# EAGLE design Relay Switch (EAGLE 9.1.3)
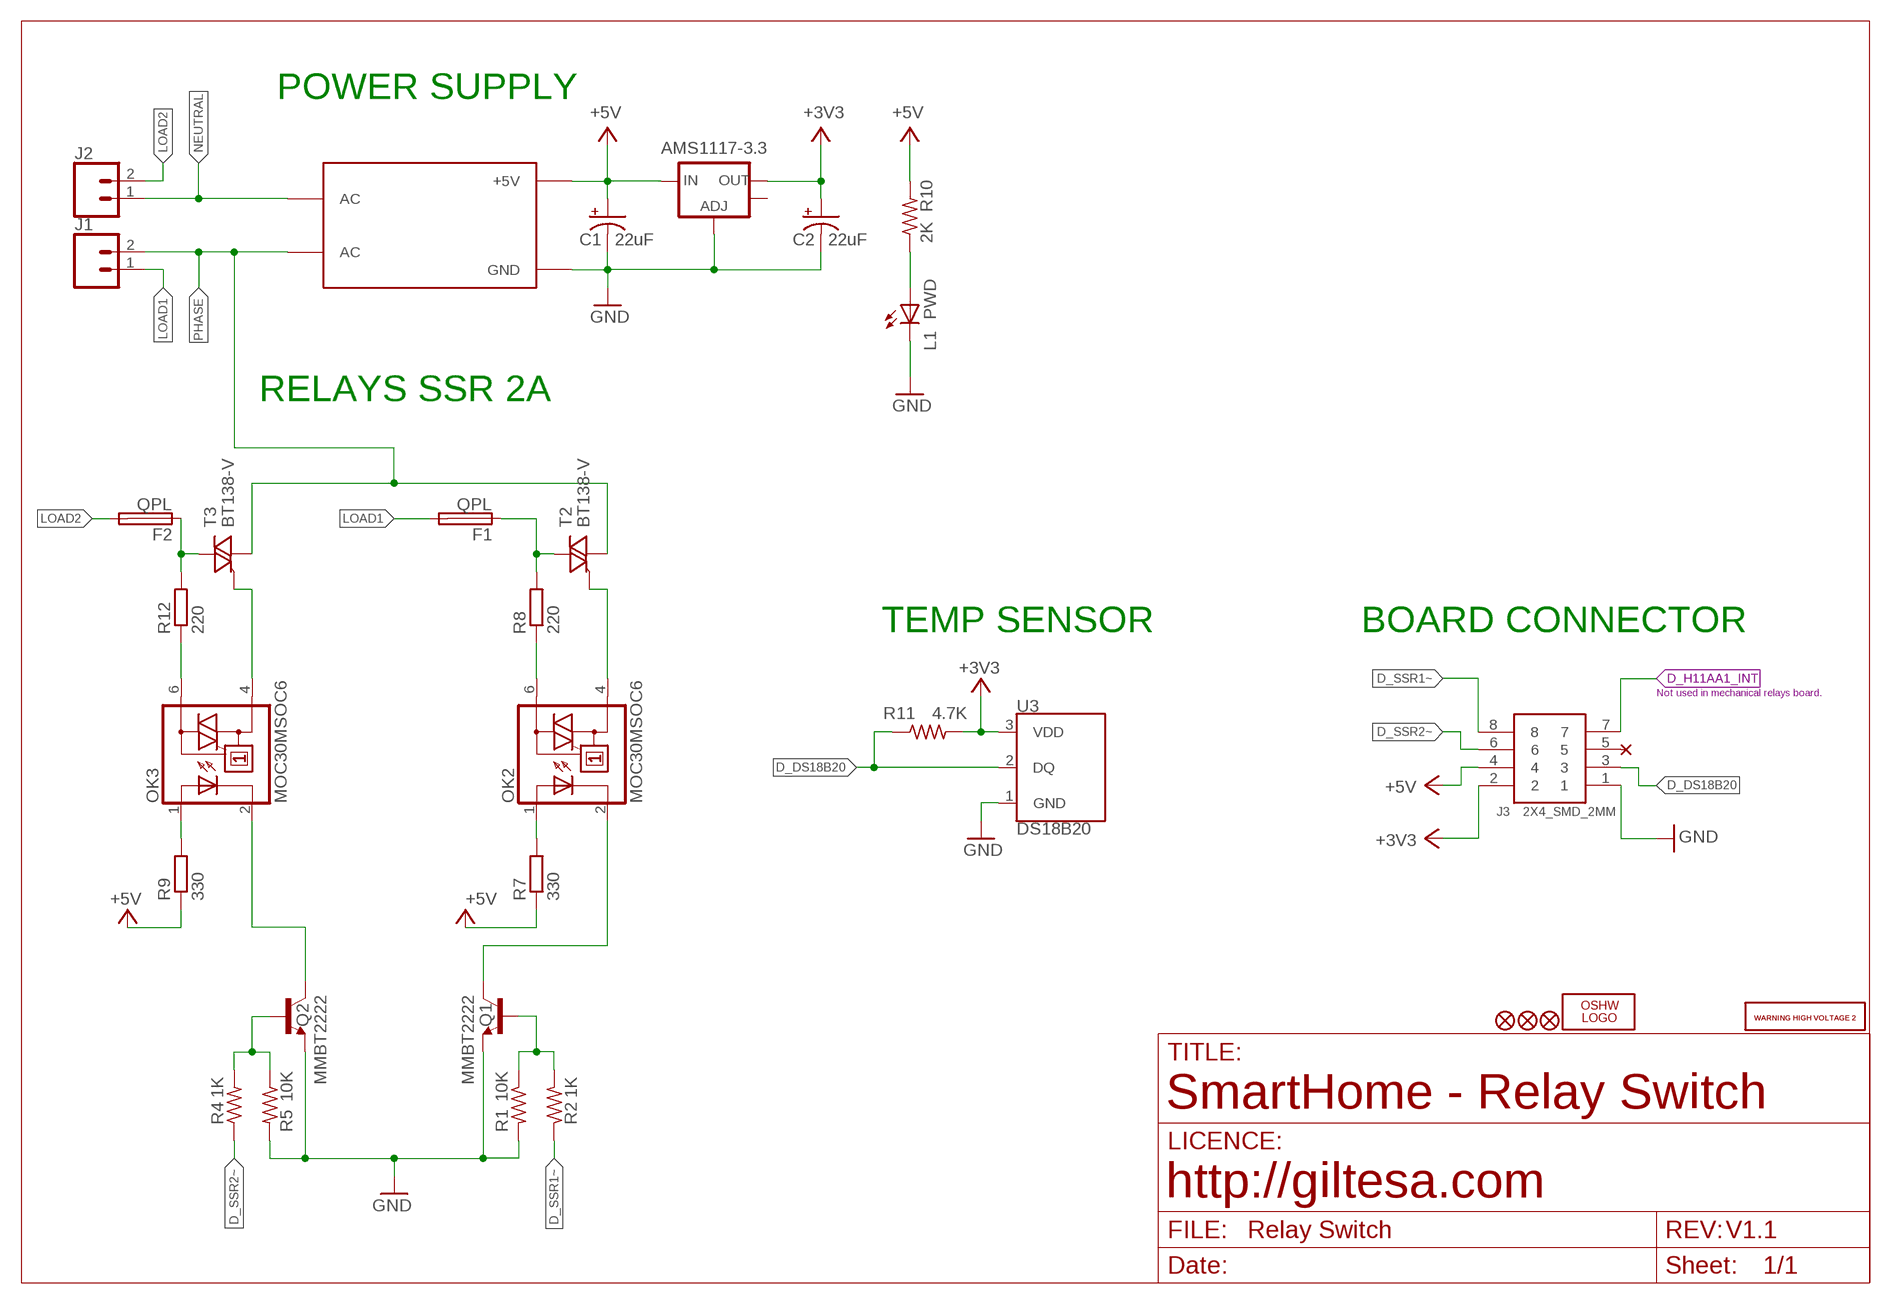
[diagram p0: schematic, sheet 1]

## Parts
AMS1117-3.3  V_REG_LM1117SOT223  [SOT223]
C1  22uF  CAP_POL3528  [EIA3528]
C2  22uF  CAP_POL3528  [EIA3528]
F1  QPL  TE5  [TE5]
F2  QPL  TE5  [TE5]
J1  TERMINAL_5MM_2P  [TERMINAL_5MM_2P]
J2  TERMINAL_5MM_2P  [TERMINAL_5MM_2P]
J3  2X4_SMD_2MM  2X4_SMD_2.0MM  [2X4_SMD_2.0MM]
L1  PWD  LEDCHIP-LED0805  [CHIP-LED0805]
LOGO1  OSHW_LOGO_FILLX0150-NT  [OSHW_FILLX150_NOTEXT]
OK2  MOC30MSOC6  [DIL6-SMD]
OK3  MOC30MSOC6  [DIL6-SMD]
Q1  MMBT2222  TRANSISTOR_NPNSOT23  [SOT23]
Q2  MMBT2222  TRANSISTOR_NPNSOT23  [SOT23]
R1  10K  R0603  [R0603]
R2  1K  R0603  [R0603]
R4  1K  R0603  [R0603]
R5  10K  R0603  [R0603]
R7  330  R-EU_M0805  [M0805]
R8  220  R-EU_M0805  [M0805]
R9  330  R-EU_M0805  [M0805]
R10  2K  R0603  [R0603]
R11  4.7K  R0603  [R0603]
R12  220  R-EU_M0805  [M0805]
T2  BT138-V  [TO220BV]
T3  BT138-V  [TO220BV]
U3  DS18B20  [DS18B20]
U$1  HILINK_HLK-PM01_5V  [HILINK_HLK-PM01_5V]
U$3  WARNING_HIGH_VOLTAGE_2  [WARNING_HIGH_VOLTAGE_2]
U$4  WARNING_HIGH_VOLTAGE_2  [WARNING_HIGH_VOLTAGE_2]
U$6  FIDUCIAL1X2  [FIDUCIAL-1X2]
U$7  FIDUCIAL1X2  [FIDUCIAL-1X2]
U$14  FIDUCIAL1X2  [FIDUCIAL-1X2]

## Nets
+3V3: AMS1117-3.3.2(OUT) C2.A(+) J3.2 R11.2 U3.3(VDD)
+5V: AMS1117-3.3.3(IN) C1.A(+) J3.4 R7.1 R9.1 R10.2 U$1.+5V
D_DS18B20: J3.3 R11.1 U3.2(DQ)
D_H11AA1_INT: J3.7
D_SSR1~: J3.8 R2.1
D_SSR2~: J3.6 R4.1
GND: AMS1117-3.3.1(ADJ) C1.C(-) C2.C(-) J3.1 L1.C Q1.2(E) Q2.2(E) R1.2 R5.2 U3.1(GND) U$1.GND
LOAD1: F1.2 J1.1
LOAD1_1: F1.1 R8.2 T2.T2(A2)
LOAD2: F2.2 J2.2
LOAD2_1: F2.1 R12.2 T3.T2(A2)
N$2: Q1.1(B) R1.1 R2.2
N$3: OK2.2(C) Q1.3(C)
N$6: OK2.1(A) R7.2
N$7: OK2.6(A2) R8.1
N$8: L1.A R10.1
N$9: OK2.4(A1) T2.G
N$10: OK3.1(A) R9.2
N$11: OK3.6(A2) R12.1
N$12: OK3.4(A1) T3.G
N$46: Q2.1(B) R4.2 R5.1
N$47: OK3.2(C) Q2.3(C)
NEUTRAL: J2.1 U$1.AC@2(AC)
PHASE: J1.2 T2.T1(A1) T3.T1(A1) U$1.AC@1(AC)
Unconnected: AMS1117-3.3.4(OUT) J3.5

## Notes on the sheet
- POWER SUPPLY
- RELAYS SSR 2A
- TEMP SENSOR | BOARD CONNECTOR
- Not used in mechanical relays board.
- SmartHome - Relay Switch
- http://giltesa.com
- V1.1

## Library data of the parts
AMS1117-3.3 = SparkFun:V_REG_LM1117: Voltage Regulator LM1117 Standard adjustable voltage regulator but in SMD form. Spark Fun Electronics SKU : COM-00595
C1 C2 = SparkFun:CAP_POL: Capacitor Polarized These are standard SMD and PTH capacitors. Normally 10uF, 47uF, and 100uF in electrolytic and tantalum varieties. Always verify the external diameter of the through hole cap, it varies with capacity, voltage, and manufacturer. The EIA devices should be standard.
F1 F2 = fuse:TE5: FUSE Wickmann; OC_FARNELL: unknown; OC_NEWARK: unknown
J1 J2 = ,giltesa:TERMINAL_5MM_2P
J3 = ,giltesa:2X4_SMD_2.0MM
L1 = led:LED: LED OSRAM: - CHIPLED LG R971, LG N971, LY N971, LG Q971, LY Q971, LO R971, LY R971 LH N974, LH R974 LS Q976, LO Q976, LY Q976 LO Q996 - Hyper CHIPLED LW Q18S LB Q993, LB Q99A, LB R99A - SideLED LS A670, LO A670, LY A670, LG A670, LP A670 LB A673, LV A673, LT A673, LW A673 LH A674 LY A675 LS A676, LA A676, LO A676, LY A676, LW A676 LS A679, LY A679, LG A679 - Hyper Micro SIDELED® LS Y876, LA Y876, LO Y876, LY Y876 LT Y87S - SmartLED LW L88C, LW L88S LB L89C, LB L89S, LG L890 LS L89K, LO L89K, LY L89K LS L896, LA L896, LO L896, LY L896 - TOPLED LS T670, LO T670, LY T670, LG T670, LP T670 LSG T670, LSP T670, LSY T670, LOP T670, LYG T670 LG T671, LOG T671, LSG T671 LB T673, LV T673, LT T673, LW T673 LH T674 LS T676, LA T676, LO T676, LY T676, LB T676, LH T676, LSB T676, LW T676 LB T67C, LV T67C, LT T67C, LS T67K, LO T67K, LY T67K, LW E67C LS E67B, LA E67B, LO E67B, LY E67B, LB E67C, LV E67C, LT E67C LW T67C LS T679, LY T679, LG T679 LS T770, LO T770, LY T770, LG T770, LP T770 LB T773, LV T773, LT T773, LW T773 LH T774 LS E675, LA E675, LY E675, LS T675 LS T776, LA T776, LO T776, LY T776, LB T776 LHGB T686 LT T68C, LB T68C - Hyper Mini TOPLED® LB M676 - Mini TOPLED Santana® LG M470 LS M47K, LO M47K, LY M47K Source: http://www.osram.convergy.de LUXEON: - LUMILED® LXK2-PW12-R00, LXK2-PW12-S00, LXK2-PW14-U00, LXK2-PW14-V00 LXK2-PM12-R00, LXK2-PM12-S00, LXK2-PM14-U00 LXK2-PE12-Q00, LXK2-PE12-R00, LXK2-PE12-S00, LXK2-PE14-T00, LXK2-PE14-U00 LXK2-PB12-K00, LXK2-PB12-L00, LXK2-PB12-M00, LXK2-PB14-N00, LXK2-PB14-P00, LXK2-PB14-Q00 LXK2-PR12-L00, LXK2-PR12-M00, LXK2-PR14-Q00, LXK2-PR14-R00 LXK2-PD12-Q00, LXK2-PD12-R00, LXK2-PD12-S00 LXK2-PH12-R00, LXK2-PH12-S00 LXK2-PL12-P00, LXK2-PL12-Q00, LXK2-PL12-R00 Source: www.luxeon.com KINGBRIGHT: KA-3528ASYC Source: www.kingbright.com
LOGO1 = ohw-logo:OSHW_LOGO_FILL
OK2 OK3 = optocoupler-3-jcn:MOC30*M: RANDOM-PHASE OPTOISOLATORS TRIAC DRIVER OUTPUT Source: http://www.fairchildsemi.com MOC3020-M.pdf
Q1 Q2 = SparkFun:TRANSISTOR_NPN: Transistor NPN BJT configuration in SOT23 package. MMBT2222 is the common NPN we use. Double check BCE configuration again layout.
R1 R2 R4 R5 R10 R11 = ,giltesa:R0603
R7-R9 R12 = resistor:R-EU_: RESISTOR, European symbol
T2 T3 = triac:BT138: TRIAC Source: http://www.semiconductors.philips.com BT138_SERIES_2.pdf
U3 = ,giltesa:DS18B20
U$1 = ,giltesa:HILINK_HLK-PM01_5V
U$3 U$4 = ,giltesa_logos:WARNING_HIGH_VOLTAGE_2
U$6 U$7 U$14 = SparkFun:FIDUCIAL: Fiducial Alignment Points Various fiducial points for machine vision alignment.

## Board
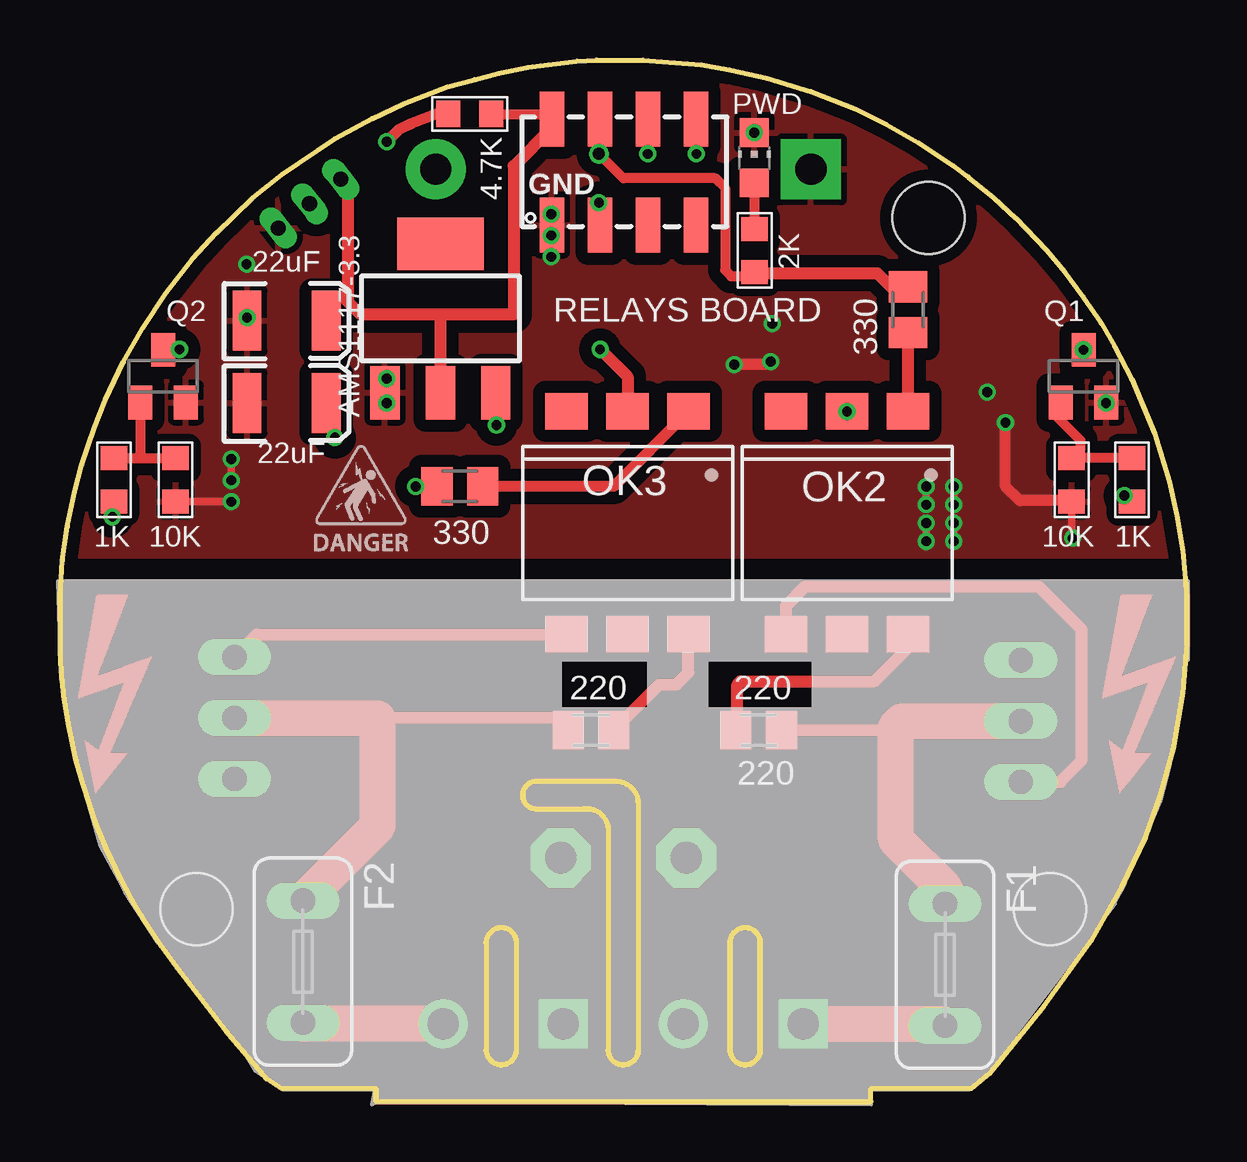
[diagram p1: board, top side]
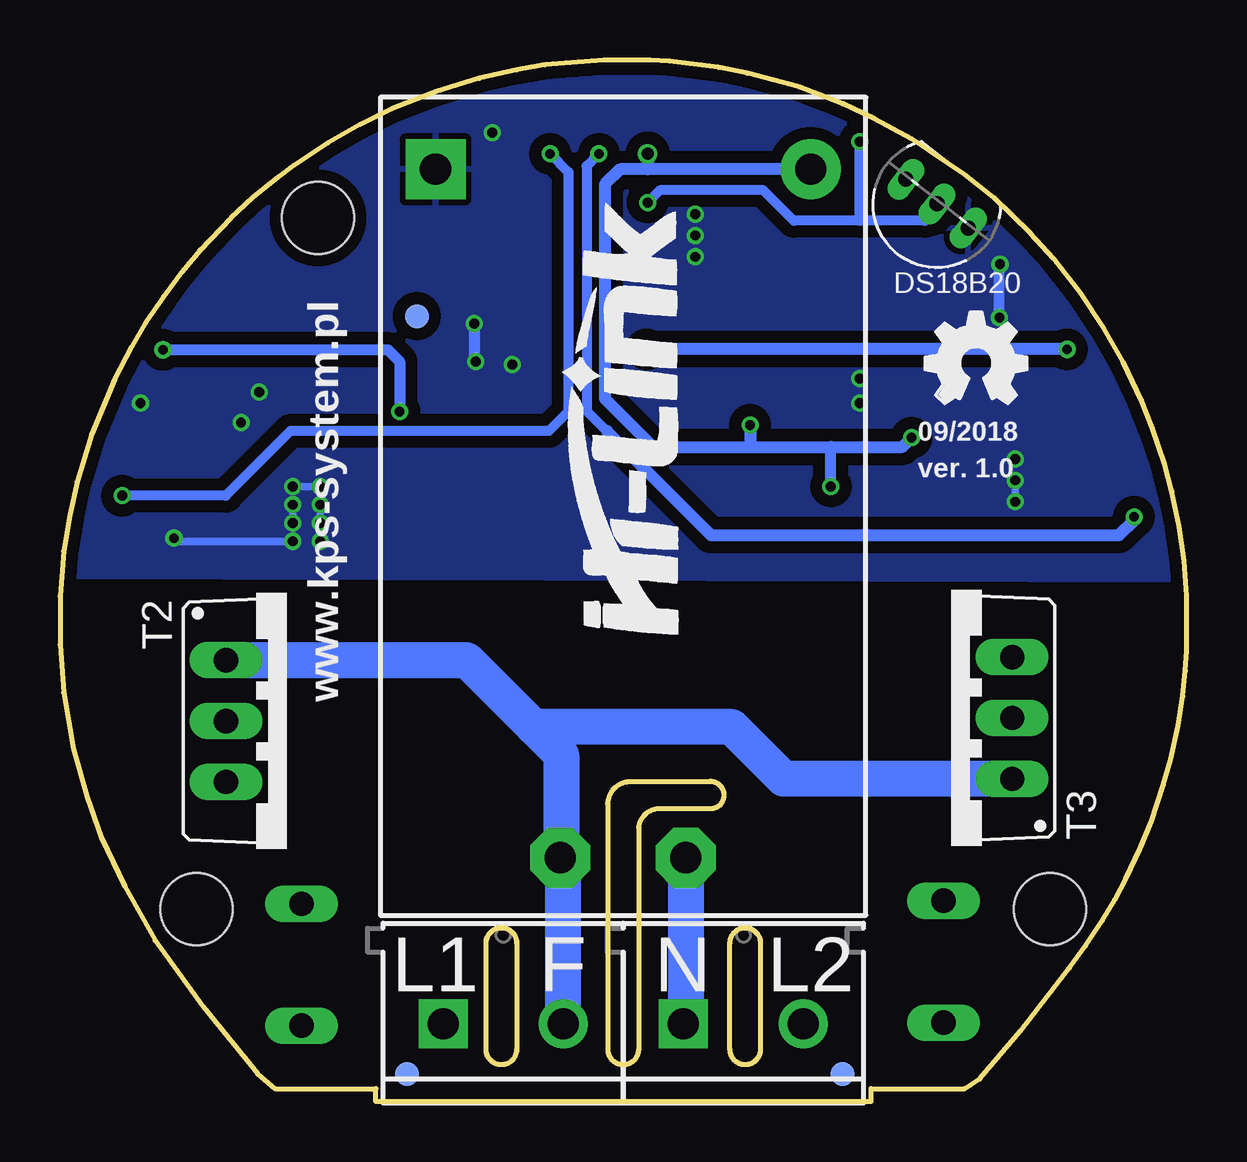
[diagram p2: board, bottom side, seen from below]

Size 46.94 x 43.43 mm. Coordinates in mm from the lower left corner, seen from the top.
Outline: 13.16,0.55 9.25,0.55 8.99,0.7 8.61,0.96 6.93,2.94 4.88,5.58 4.22,6.49 3.51,7.56 3,8.42 2.54,9.29 1.93,10.56 1.47,11.68 0.97,13.2 0.66,14.27 0.36,15.69 0.15,16.91 0.05,17.98 0,18.79 0,21.07 0.1,22.55 0.3,23.97 0.61,25.44 0.91,26.56 1.42,28.08 1.88,29.25 2.64,30.83 3.45,32.25 4.42,33.72 5.54,35.15 6.5,36.21 8.03,37.69 9.25,38.65 11.43,40.12 13,40.99 14.33,41.6 16.15,42.31 17.27,42.61 18.29,42.87 19.51,43.12 21.54,43.38 22.35,43.43 24.28,43.43 26.72,43.22 27.89,43.02 29.46,42.66 31.29,42.11 33.12,41.39 34.44,40.73 35.76,39.97 37.24,39.01 37.85,38.55 38.91,37.69 39.83,36.82 41.1,35.5 41.86,34.59 42.62,33.57 43.38,32.45 43.94,31.49 44.65,30.12 45.62,27.83 46.23,25.85 46.53,24.43 46.79,22.95 46.94,21.07 46.94,19.04 46.79,17.06 46.38,14.72 45.82,12.74 45.21,11.02 44.25,8.98 42.98,6.72 40.97,3.95 38.71,1.16 37.97,0.55 33.78,0.55 33.78,0 13.16,0 13.16,0.55
Outline: 22.83,2.18 arc180 24.1,2.18 24.1,12.34 arc90 23.22,13.35 19.91,13.35 arc180 19.79,12.21 21.82,12.21 arc-90 22.83,11.45 22.83,2.18
Outline: 17.75,2.18 arc180 19.02,2.18 19.02,6.62 arc180 17.75,6.62 17.75,2.18
Outline: 27.91,2.18 arc180 29.18,2.18 29.18,6.62 arc180 27.91,6.62 27.91,2.18
Copper layers (1*16): Top 0.035mm / dielectric 1.6mm / Bottom 0.035mm
Design rules "default *": minimum track width 6mil, minimum drill 16mil, track to track 6mil, track to pad 6mil, pad to pad 6mil, via to via 8mil, smd to smd 0mil, copper to edge 20mil, drill to drill 10mil, minimum pad ring 6mil, minimum via ring 6mil, stop-mask expansion 0mil, vias tented up to drill 100mil, thermal gap 10mil
Holes 3 mm at 5.69,8.03 41.25,8.03 36.19,36.84

### Footprints (pad centres in the part's own frame; a part is rotated, then mirrored left to right if it is on the bottom)
SOT223 = smd 1.219 x 2.235: 1 -2.311,-3.099; 2 0,-3.099; 3 2.311,-3.099 | smd 3.6 x 2.2: 4 0,3.099
EIA3528 = smd 1.2 x 2.5: A 1.65,0; C -1.65,0
TE5 = drill 1.016 long: 1 -2.54,0; 2 2.54,0
TERMINAL_5MM_2P = drill 1.3 pad 2.032 square: 1 0,0 | drill 1.3 pad 2.032: 2 5,0
2X4_SMD_2.0MM = smd 2.286 x 1.016: 1 -2.213,2.976; 2 2.212,2.976; 3 -2.213,0.976; 4 2.212,0.976; 5 -2.213,-1.024; 6 2.212,-1.024; 7 -2.213,-3.024; 8 2.212,-3.024
CHIP-LED0805 = smd 1.2 x 1.2: A 0,-1.05; C 0,1.05
DIL6-SMD = smd 1.78 x 1.52: 1 -2.54,-4.645; 2 0,-4.645; 3 2.54,-4.645; 4 2.54,4.645; 5 0,4.645; 6 -2.54,4.645
SOT23 = smd 1 x 1.4: 1 -0.95,-1.1; 2 0.95,-1.1; 3 0,1.1
R0603 = smd 1 x 1.1: 1 -0.901,0.013; 2 0.901,0.013
M0805 = smd 1.3 x 1.6: 1 -0.95,0; 2 0.95,0
TO220BV = drill 1.016 long: G 2.54,-2.54; T1 -2.54,-2.54; T2 0,-2.54
DS18B20 = drill 0.635 pad 0.864 long: 1 -1.651,0; 2 0,0; 3 1.651,0
HILINK_HLK-PM01_5V = drill 1.3 pad 2.5: +5V 31.109,2.3 | drill 1.3 pad 2.5 octagon: AC@1 2.409,12.73; AC@2 2.409,7.5 | drill 1.3 pad 2.5 square: GND 31.109,17.93
FIDUCIAL-1X2 = smd 1 x 1: 1 0,0

### Placement (x,y rotation side)
AMS1117-3.3  15.85,32.66 0 top
C1  9.45,29.13 0 top
C2  9.45,32.56 0 top
F1  36.88,5.71 270 top
F2  10.12,5.84 270 top
J1  30.97,3.25 0 bottom
J2  20.97,3.25 0 bottom
J3  23.47,38.75 90 top
L1  28.93,39.35 0 top
LOGO1  10.9,29.1 0 bottom
OK2  32.79,24.13 180 top
OK3  23.65,24.13 180 top
Q1  42.65,30.24 0 top
Q2  4.29,30.24 0 top
R1  42.14,25.93 270 top
R2  44.68,25.93 90 top
R4  2.26,25.93 90 top
R5  4.8,25.93 270 top
R7  35.33,33.02 270 top
R8  29.11,15.49 0 top
R9  16.66,25.65 0 top
R10  28.93,35.48 270 top
R11  17.07,41.16 0 top
R12  22.12,15.49 180 top
T2  37.49,15.87 270 bottom
T3  9.8,16 90 bottom
U3  10.4,37.44 142 bottom
U$1  13.36,7.76 90 bottom
U$2  [ELECTROCUTION_SMALL]  10.35,22.84 0 top
U$3  0.36,12.97 0 top
U$4  43.03,12.97 0 top
U$6  32.49,1.16 90 bottom
U$7  14.33,1.16 90 bottom
U$14  32.07,32.74 90 bottom

### Tracks (layer width: path | path; a pad name or v marks a point on that pad's centre or on a via)
+3V3
  Top 0.406: R11.2 20.49,41.17 J3.2
  Top 0.508: J3.2 20.49,40.6 18.9,39.01 18.9,32.82 15.85,32.82 | 15.85,32.82 AMS1117-3.3.2 | 15.85,32.82 12.53,32.82 12.02,33.34 | 12.02,33.34 12.02,37.93 U3.3 | 12.02,33.34 11.83,33.52 11.2,33.52 11.2,32.66 C2.A
+5V  (via drill 0.41, 0.51)
  Top 0.406: v22.45,39.51 23.47,38.5 27.31,38.5 27.71,38.1 27.71,34.67 27.97,34.41 28.78,34.41 | 28.85,34.41 28.78,34.41 | 28.78,34.41 R10.2
  Top 0.508: J3.4 22.49,39.81 v22.45,39.51 | v11.46,27.68 11.46,28.77 C1.A | R10.2 28.98,34.54 34.06,34.54 34.64,33.97 R7.1 | R9.1 v14.82,25.65 | AMS1117-3.3.3 18.19,29.53 v18.19,28.21
  Bottom 0.457: v14.82,25.65 14.82,27.3
  Bottom 0.508: U$1.+5V 22.45,38.87 | 22.45,38.87 23.6,38.87 24.23,38.24 24.23,29.3 22.23,27.3 18.19,27.3 | v22.45,39.51 22.45,38.87 | v11.46,27.68 11.84,27.3 14.82,27.3 18.19,27.3 | v18.19,28.21 18.19,27.3
D_DS18B20  (via drill 0.41)
  Top 0.406: v22.45,37.48 22.45,36.58 J3.3
  Top 0.457: R11.1 15.69,41.17 14.63,40.76 14.12,40.53 v13.61,40.02
  Bottom 0.406: U3.2 10.56,37.05 10.9,36.72 13.61,36.72 | 13.61,36.72 16.36,36.72 17.63,37.99 21.95,37.99 v22.45,37.48 | 13.61,36.72 v13.61,40.02
D_SSR1~  (via drill 0.41)
  Top 0.406: v26.52,39.51 26.52,40.94 J3.8 | v44.35,25.27 44.42,25.27 R2.1
  Bottom 0.406: v26.52,39.51 25.76,38.75 25.76,28.77 26.57,27.96 37.34,27.96 40.03,25.27 v44.35,25.27
D_SSR2~  (via drill 0.41)
  Top 0.406: v24.49,39.51 J3.6
  Top 0.508: v2.18,24.38 2.25,24.44 R4.1
  Bottom 0.406: v24.49,39.51 24.99,39.01 24.99,28.8 24.16,27.96
  Bottom 0.508: 24.16,27.96 19.82,23.62 2.82,23.62 2.18,24.25 v2.18,24.38
GND  (via drill 0.41)
  Top 0.305: R1.2 42.15,23.53 v42.19,23.49 | v37.24,23.36 v37.24,24.13 | v37.24,24.89 v37.24,25.65 | v36.09,25.65 v36.09,24.89 | v36.09,24.13 v36.09,23.36 | R5.2 7.13,25.02 v7.14,25.01 | v7.14,25.9 v7.14,26.79
  Top 0.457: v29.62,30.86 29.49,30.73 v28.09,30.73 | R1.2 42.12,25.05 39.99,25.05 39.4,25.65 v39.4,28.32
  Bottom 0.305: v42.19,23.49 42.06,23.36 v37.24,23.36 | v37.24,24.13 v37.24,24.89 | v37.24,25.65 v36.09,25.65 | v36.09,24.89 v36.09,24.13 | v7.14,25.01 v7.14,25.9
  Bottom 0.457: v7.8,32.69 7.8,34.9 v7.77,34.92 | v29.68,32.44 29.68,30.92 v29.62,30.86
  other vias: 43.59,29.13 13.61,30.14 13.61,29.13 20.47,37 20.47,36.11 20.47,35.22 28.93,40.4 38.63,29.59
  pour Top (isolate 0.508): -0.15,22.75 46.86,22.75 46.86,24.2 46.33,26.31 45.06,29.48 42.52,33.93 39.98,37.1 35.53,40.28 29.82,42.82 24.74,43.45 20.93,43.45 15.85,42.18 10.77,39.64 6.96,36.47 3.78,32.66 2.36,30.28
  pour Bottom (isolate 0.508): -0.11,21.74 46.89,21.87 46.89,21.46 46.91,21.48 46.89,22.73 45.06,29.48 42.52,33.93 39.98,37.1 35.53,40.28 29.82,42.82 24.74,43.45 20.93,43.45 15.85,42.18 10.77,39.64 6.96,36.47 3.78,32.66 2.01,29.71 0.03,21.84 0.03,22.09
LOAD1
  Top 1.5: J1.1 36.8,3.25 F1.2
LOAD1_1
  Top 0.508: R8.2 34.7,15.49 34.82,15.62
  Top 1.5: F1.1 36.88,8.87 34.82,10.92 34.82,15.62 35.08,15.87 T2.T2
LOAD2
  Top 1.5: J2.2 10.17,3.25 F2.2
LOAD2_1
  Top 0.508: R12.2 20.67,16 13.23,16
  Top 1.5: T3.T2 13.23,16 13.23,11.49 F2.1
N$2
  Top 0.406: R2.2 R1.1 42.52,27.22 42.52,27.58 41.44,28.65 Q1.1
N$3  (via drill 0.41)
  Bottom 0.457: Q1.3 33.28,31.34 32.79,30.86 OK2.2
  other vias: 42.65,31.34 32.79,28.77
N$6
  Top 0.508: R7.2 OK2.1
N$7
  Top 0.508: R8.1 28.22,15.55 28.22,17.39 28.35,17.52 33.93,17.52 35.33,18.92 OK2.6
N$8
  Top 0.406: R10.1 28.94,38.29 L1.A
N$9
  Top 0.508: OK2.4 30.25,20.7 31.01,21.46 40.79,21.46 42.57,19.68 42.57,14.22 41.68,13.33 T2.G
N$10
  Top 0.457: OK3.1 23.07,25.65 R9.2
N$11
  Top 0.508: R12.1 24.98,17.39 25.68,17.39 26.19,17.9 OK3.6
N$12
  Top 0.508: T3.G 8.21,19.48 OK3.4
N$46
  Top 0.406: R4.2 3.2,26.83 | 3.2,26.83 R5.1 | Q2.1 3.34,26.97 3.2,26.83
N$47  (via drill 0.41)
  Top 0.508: Q2.3 4.96,31.34 v4.98,31.36 | v22.5,31.36 23.65,30.22 OK3.2
  Bottom 0.508: v4.98,31.36 v22.5,31.36
NEUTRAL
  Bottom 1.5: U$1.AC@2 20.86,3.35 J2.1
PHASE
  Bottom 1.5: J1.2 25.97,10.05 26.06,10.14 | 26.06,10.14 U$1.AC@1 | T2.T1 30,18.41 27.2,15.62 | 26.06,10.14 26.06,14.47 27.2,15.62 | T3.T1 16.79,13.46 18.95,15.62 27.2,15.62

### Text on the board
tPlace: GND | RELAYS BOARD | 330 | 330 | 220 | 220 | 220
bPlace: www.kps-system.pl | 09/2018 | ver. 1.0 | L2 | N | F | L1